# EAGLE design flexglove (EAGLE 7.7.0)
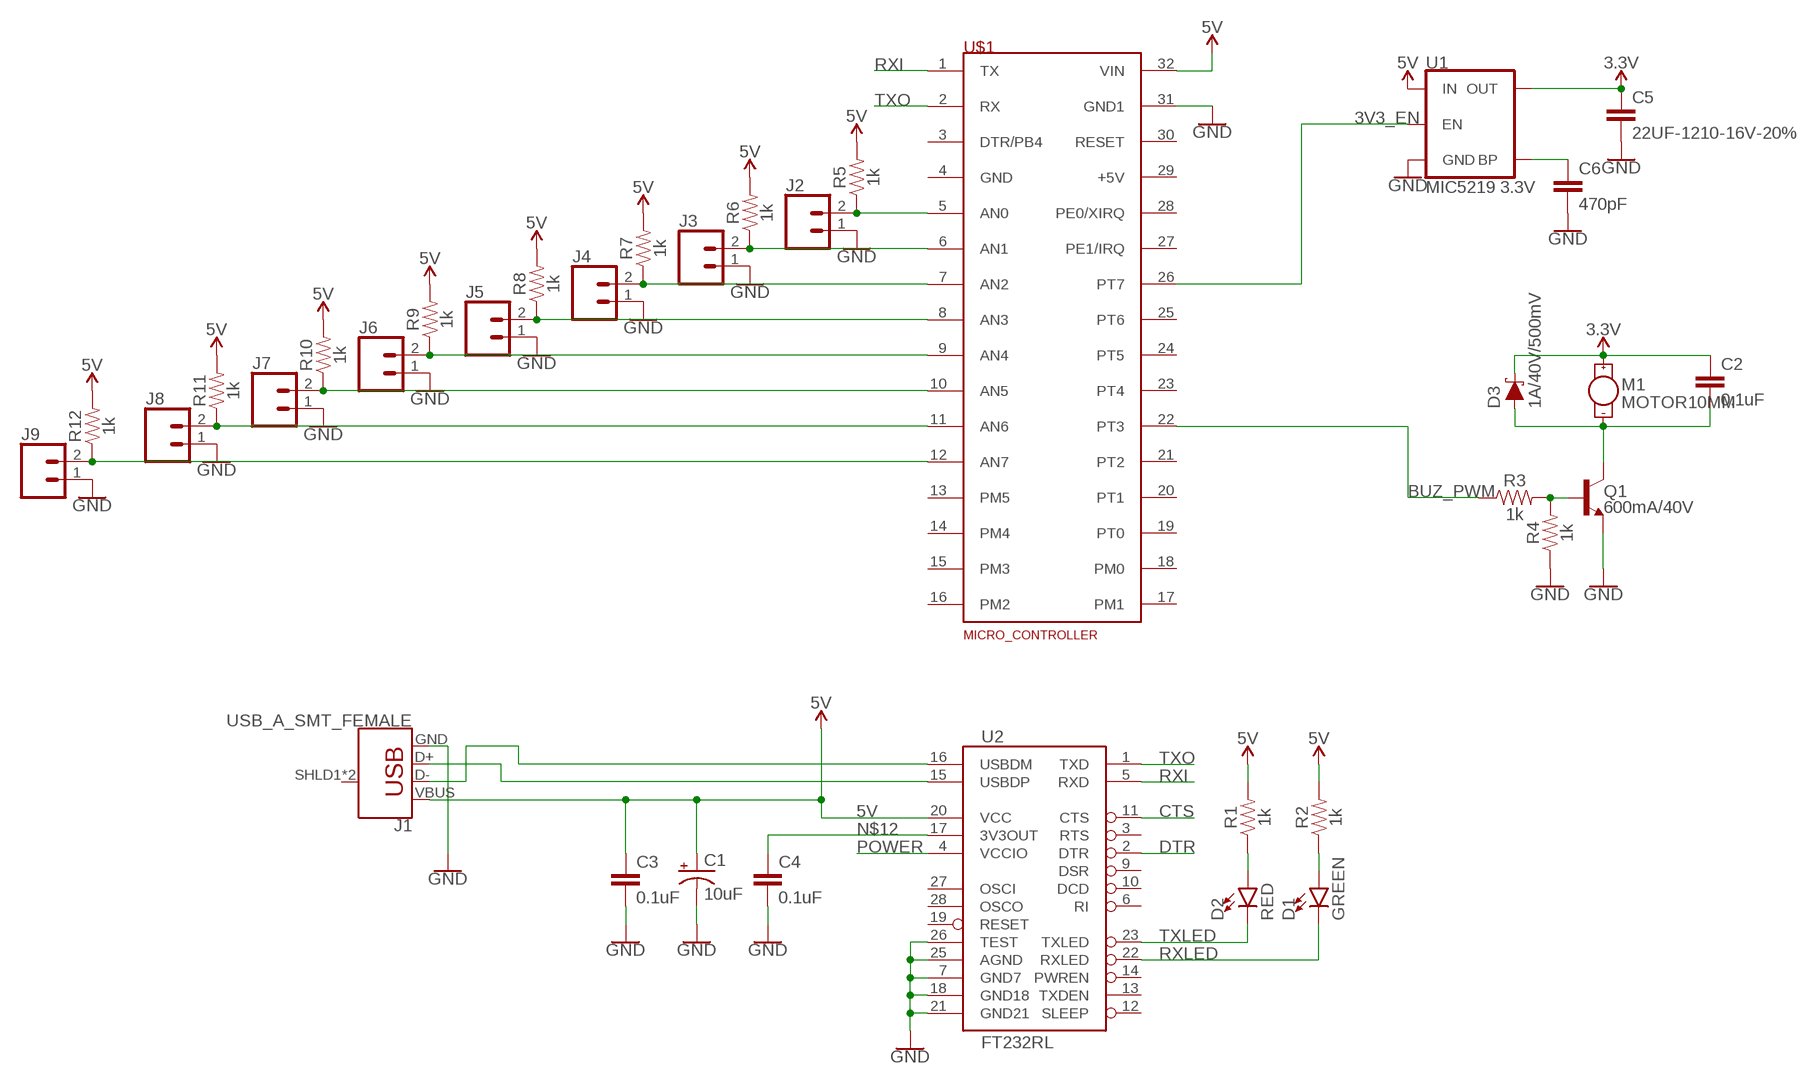
[diagram p0: schematic, sheet 1]

## Parts
C1  10uF  10UF-POLAR-EIA3216-16V-10%(TANT)  [EIA3216]
C2  0.1uF  0.1UF-0603-25V-5%  [0603]
C3  0.1uF  0.1UF-0603-25V-5%  [0603]
C4  0.1uF  0.1UF-0603-25V-5%  [0603]
C5  22UF-1210-16V-20%  [1210]
C6  470pF  470PF-0603-50V-5%  [0603]
D1  GREEN  LED-GREEN0603  [LED-0603]
D2  RED  LED-RED0603  [LED-0603]
D3  1A/40V/500mV  DIODE-SCHOTTKY-SS14  [SMA-DIODE]
J1  USB_A_SMT_FEMALE  [USB-A-S-SILK-FEMALE]
J2  CONN_02  [1X02]
J3  CONN_02  [1X02]
J4  CONN_02  [1X02]
J5  CONN_02  [1X02]
J6  CONN_02  [1X02]
J7  CONN_02  [1X02]
J8  CONN_02  [1X02]
J9  CONN_02  [1X02]
M1  MOTOR10MM  [VIBE-MOTOR-10MM]
Q1  600mA/40V  TRANS_NPN-MMBT2222AL  [SOT23-3]
R1  1k  1KOHM-0603-1/10W-1%  [0603]
R2  1k  1KOHM-0603-1/10W-1%  [0603]
R3  1k  1KOHM-0603-1/10W-1%  [0603]
R4  1k  1KOHM-0603-1/10W-1%  [0603]
R5  1k  1KOHM-0603-1/10W-1%  [0603]
R6  1k  1KOHM-0603-1/10W-1%  [0603]
R7  1k  1KOHM-0603-1/10W-1%  [0603]
R8  1k  1KOHM-0603-1/10W-1%  [0603]
R9  1k  1KOHM-0603-1/10W-1%  [0603]
R10  1k  1KOHM-0603-1/10W-1%  [0603]
R11  1k  1KOHM-0603-1/10W-1%  [0603]
R12  1k  1KOHM-0603-1/10W-1%  [0603]
U1  MIC5219 3.3V  V_REG_MIC52193.3V  [SOT23-5]
U2  FT232RL  FT232RLSSOP  [SSOP28DB]
U$1  MICRO_CONTROLLER  [MICRO_CONTROLLER]

## Nets
3.3V [power]: C2.1 C5.1 D3.C M1.+ U1.5(OUT)
3V3_EN: U1.3(EN) U$1.26(PT7)
5V: C1.+ C3.1 J1.VBUS R1.2 R2.2 R5.2 R6.2 R7.2 R8.2 R9.2 R10.2 R11.2 R12.2 U1.1(IN) U2.20(VCC) U$1.32(VIN)
BUZ_PWM: R3.1 U$1.22(PT3)
CTS: U2.11(CTS)
DTR: U2.2(DTR)
GND [power]: C1.- C3.2 C4.2 C5.2 C6.2 J1.GND J2.1 J3.1 J4.1 J5.1 J6.1 J7.1 J8.1 J9.1 Q1.2(E) R4.1 U1.2(GND) U2.7(GND7) U2.18(GND18) U2.21(GND21) U2.25(AGND) U2.26(TEST) U$1.31(GND1)
N$1: D2.A R1.1
N$2: D1.A R2.1
N$3: J2.2 R5.1 U$1.5(AN0)
N$4: J3.2 R6.1 U$1.6(AN1)
N$5: J5.2 R8.1 U$1.8(AN3)
N$6: J6.2 R9.1 U$1.9(AN4)
N$7: J7.2 R10.1 U$1.10(AN5)
N$8: J4.2 R7.1 U$1.7(AN2)
N$9: J8.2 R11.1 U$1.11(AN6)
N$10: J9.2 R12.1 U$1.12(AN7)
N$11: Q1.1(B) R3.2 R4.2
N$12 [power]: C4.1 U2.17(3V3OUT)
N$13: C2.2 D3.A M1.- Q1.3(C)
N$14: C6.1 U1.4(BP)
POWER: U2.4(VCCIO)
RXI: U2.5(RXD) U$1.1(TX)
RXLED: D1.C U2.22(RXLED)
TXLED: D2.C U2.23(TXLED)
TXO: U2.1(TXD) U$1.2(RX)
USB_D+: J1.D+ U2.15(USBDP)
USB_D-: J1.D- U2.16(USBDM)
Unconnected: J1.SHLD1(SHIELD) J1.SHLD2(SHIELD) U2.3(RTS) U2.6(RI) U2.9(DSR) U2.10(DCD) U2.12(SLEEP) U2.13(TXDEN) U2.14(PWREN) U2.19(RESET) U2.27(OSCI) U2.28(OSCO) U$1.3(DTR/PB4) U$1.4(GND) U$1.13(PM5) U$1.14(PM4) U$1.15(PM3) U$1.16(PM2) U$1.17(PM1) U$1.18(PM0) U$1.19(PT0) U$1.20(PT1) U$1.21(PT2) U$1.23(PT4) U$1.24(PT5) U$1.25(PT6) U$1.27(PE1/IRQ) U$1.28(PE0/XIRQ) U$1.29(+5V) U$1.30(RESET)

## Library data of the parts
C1 = SparkFun-Capacitors:10UF-POLAR: 10.0µF polarized capacitors A capacitor is a passive two-terminal electrical component used to store electrical energy temporarily in an electric field.; PROD_ID: CAP-00811
C2-C4 = SparkFun-Capacitors:0.1UF: 0.1µF ceramic capacitors A capacitor is a passive two-terminal electrical component used to store electrical energy temporarily in an electric field.; PROD_ID: CAP-08604
C5 = SparkFun-Capacitors:22UF: 22µF ceramic capacitors A capacitor is a passive two-terminal electrical component used to store electrical energy temporarily in an electric field.
C6 = SparkFun-Capacitors:470PF: 470pF ceramic capacitors A capacitor is a passive two-terminal electrical component used to store electrical energy temporarily in an electric field.; PROD_ID: CAP-07884
D1 = SparkFun-LED:LED-GREEN: Green SMD LED Used in manufacturing of various products at SparkFun Packages: 0603 - SMD 0603 package [Product Link] <http://www.futureelectronics.com/en/technologies/semiconductors/optoelectronics/leds/Pages/9894312-LTST-C190GKT.aspx?CrossPart=HSMG-C190&IM=0> LilyPad 1206 - SMD1206 LilyPad package [Product Link] <http://www.futureelectronics.com/en/Technologies/Product.aspx?ProductID=IN150NGHARVATEKCORPORATION2049943&IM=0> 1206 - SMD1206 package [Product Link] <http://www.futureelectronics.com/en/technologies/semiconductors/optoelectronics/leds/Pages/8315665-LTST-C150KGKT.aspx?IM=0> 1206 Bottom Mount -SMD 1206 Bottom Mount [Product Link] <http://www.digikey.com/product-detail/en/lite-on-inc/LTST-C230KGKT/160-1456-1-ND/386854> SparkFun Products: Pro Mini 328 -5V <https://www.sparkfun.com/products/821> RedBoard <https://www.sparkfun.com/products/12757> MP3 Trigger <https://www.sparkfun.com/products/13720> Makey Makey <https://www.sparkfun.com/products/11076>; PROD_ID: DIO-00821
D2 = SparkFun-LED:LED-RED: Red SMD LED Used in manufacturing of most products at SparkFun Packages: 0603 - SMD 0603 package [Product Link] <http://docs.avagotech.com/docs/AV02-0551EN> 0603 SMART - SMD 0603 SMART package ( more efficient and expensive)[Product Link] <http://www.osram-os.com/Graphics/XPic2/00077099_0.pdf> 1206 - SMD1206 package [Product Link] <https://www.sparkfun.com/datasheets/DevTools/LilyPad/Q150OVS4.pdff> SparkFun Products: Pro Mini 328 -5V <https://www.sparkfun.com/products/821> RedBoard <https://www.sparkfun.com/products/12757> IOIO-OTG <https://www.sparkfun.com/products/13613>; PROD_ID: DIO-00819
D3 = SparkFun-DiscreteSemi:DIODE-SCHOTTKY: Schottky diode A Schottky diode is a semiconductor diode which has a low forward voltage drop and a very fast switching action.; PROD_ID: DIO-08053
J1 = SparkFun-Connectors:USB_A: USB-A Connector Male and female variants, as well as PTH and SMT variants SparkFun Products: SparkFun XBee Explorer Dongle <https://www.sparkfun.com/products/11697> PTH Male SparkFun MicroView-USB Programmer <https://www.sparkfun.com/products/12924> SMT Male SparkFun USB Type A Female Breakout <https://www.sparkfun.com/products/12700> SMT Female; PROD_ID: CONN-09520; SF_ID: PRT-09011
J2-J9 = SparkFun-Connectors:CONN_02: Multi connection point. Often used as Generic Header-pin footprint for 0.1 inch spaced/style header connections On any of the 0.1 inch spaced packages, you can populate with these: Break Away Headers - Straight <https://www.sparkfun.com/products/116> (PRT-00116) Break Away Male Headers - Right Angle <https://www.sparkfun.com/products/553> (PRT-00553) Female Headers <https://www.sparkfun.com/products/115> (PRT-00115) Break Away Headers - Machine Pin <https://www.sparkfun.com/products/117> (PRT-00117) Break Away Female Headers - Swiss Machine Pin <https://www.sparkfun.com/products/743> (PRT-00743) For SCREWTERMINALS and SPRING TERMINALS visit here: Screw Terimnals on SparkFun.com <https://www.sparkfun.com/search/results?term=Screw+Terminals> (5mm/3.5mm/2.54mm spacing) This device is also useful as a general connection point to wire up your design to another part of your project. Our various solder wires solder well into these plated through hole pads. Hook-Up Wire - Assortment (Stranded, 22 AWG) <https://www.sparkfun.com/products/11375> (PRT-11375) Hook-Up Wire - Assortment (Solid Core, 22 AWG) <https://www.sparkfun.com/products/11367> (PRT-11367) View the entire wire category on our website here <https://www.sparkfun.com/categories/141> Special notes: Molex polarized connector foot print use with: PRT-08233 with associated crimp pins and housings. 2.54_SCREWTERM for use with PRT-10571. 3.5mm Screw Terminal footprints for PRT-08084 5mm Screw Terminal footprints for use with PRT-08432
M1 = SparkFun-Electromechanical:MOTOR: Motor (Single-Phase) Two-terminal, single-phase motors. SparkFun Products Vibration Motor <https://www.sparkfun.com/products/8449> (ROB-08449) Physical dimension and wire connections for this powerful vibration motor. Motor has a self adhesive backing.; PROD_ID: COMP-08572; SF_SKU: ROB-08449
Q1 = SparkFun-DiscreteSemi:TRANS_NPN: NPN transistor Current controlled devices typically used to amplify current or used as a switch. BC547 - COM-08928 <http://www.sparkfun.com/products/8928> (TO-92 45V 100mA) (1.Collector 2.Base 3.Emitter) 2N3904 - COM-00521 <http://www.sparkfun.com/products/521> (TO-92 40V 200mA) (1.Emitter 2.Base 3.Collector) P2N2222A - COM-12852 <http://www.sparkfun.com/products/12852> (TO-92 40V 600mA) (1.Collector 2.Base 3.Emitter); PROD_ID: TRANS-08049
R1-R12 = SparkFun-Resistors:1KOHM: 1kΩ resistor A resistor is a passive two-terminal electrical component that implements electrical resistance as a circuit element. Resistors act to reduce current flow, and, at the same time, act to lower voltage levels within circuits. - Wikipedia; PROD_ID: RES-07856
U1 = SparkFun-IC-Power:V_REG_MIC5219: V_REG MIC5219 Standard 3.3V and 5V 500mA LDO voltage regulator in SOT-23 layout. Micrel part MIC5219. BP (by-pass) pin is used to lower output noise with 470pF cap, may be left open.; PROD_ID: VREG-09872
U2 = SparkFun-IC-Comms:FT232RL: FT232RL USB UART FT232RL 4th Generation USB UART (USB <-> Serial) Controller. Datasheet <http://www.sparkfun.com/datasheets/IC/FT232R_v104.pdf> SparkFun Products Component <https://www.sparkfun.com/products/650> (COM-00650) SparkFun RedBot Mainboard <https://www.sparkfun.com/products/12097> (ROB-12097) SparkFun FTDI Basic Breakout - 5V <https://www.sparkfun.com/products/9716> (DEV-09716) SparkFun FTDI Basic Breakout - 3.3V <https://www.sparkfun.com/products/9873> (DEV-09873) Bus Pirate - v3.6a <https://www.sparkfun.com/products/12942> (TOL-12942) SparkFun USB to Serial Breakout - FT232RL <https://www.sparkfun.com/products/12731> (BOB-12731) SparkFun PicoBoard <https://www.sparkfun.com/products/11888> (WIG-11888) SparkFun RFID USB Reader <https://www.sparkfun.com/products/9963> (SEN-09963) LilyPad FTDI Basic Breakout - 5V <https://www.sparkfun.com/products/10275> (DEV-10275) SparkFun Stepoko <https://www.sparkfun.com/products/13899> (ROB-13899); PROD_ID: IC-00870
U$1 = mini_project_parts:MICRO_CONTROLLER

## Net classes
0 default: width 0.203 mm
1 power: width 0.254 mm

## Board
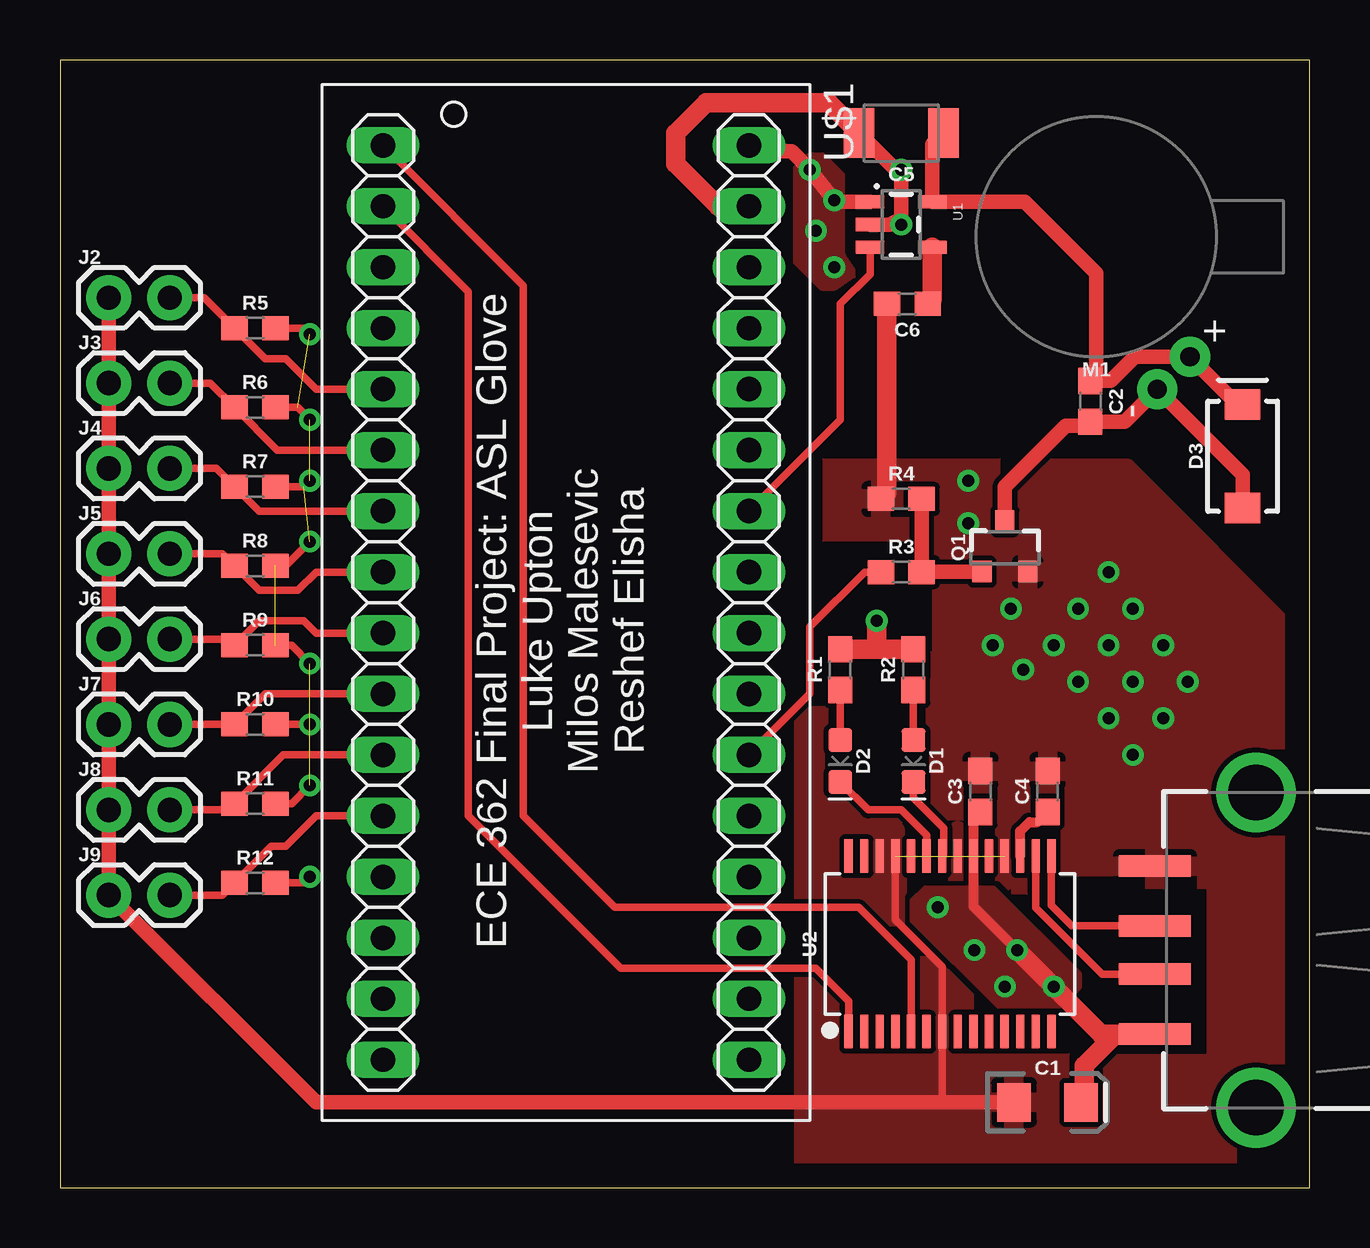
[diagram p1: board, top side]
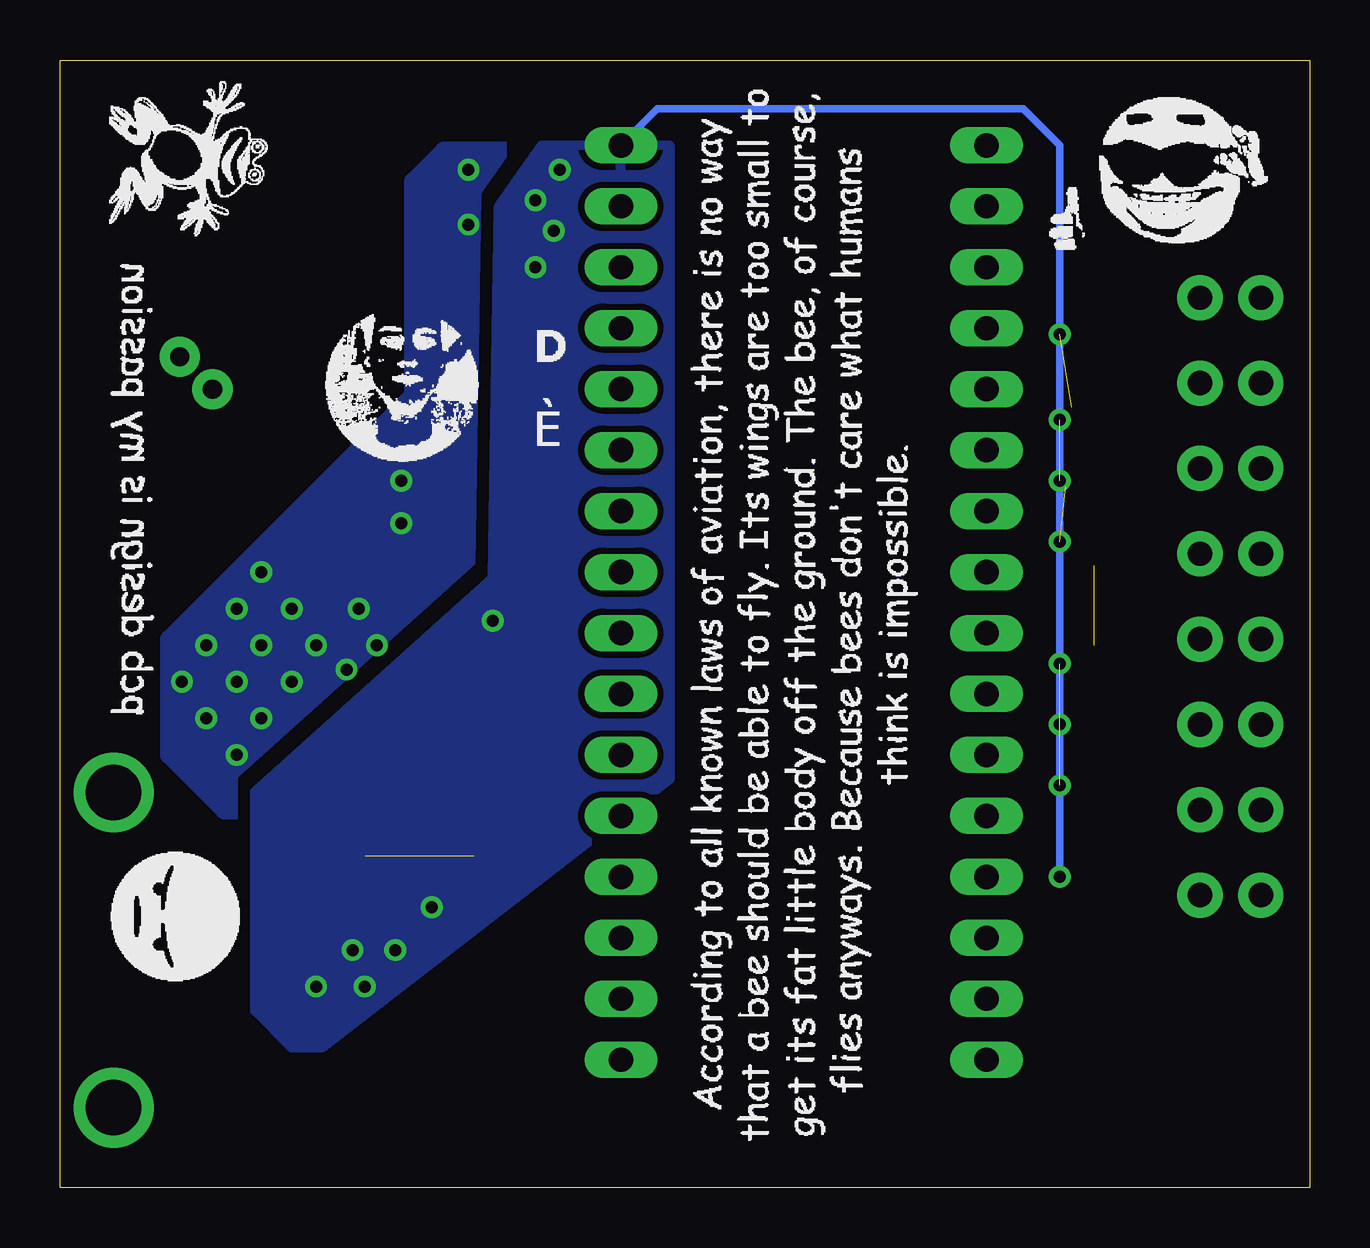
[diagram p2: board, bottom side, seen from below]

Size 52.07 x 46.99 mm. Coordinates in mm from the lower left corner, seen from the top.
Outline: 0,0 52.07,0 52.07,46.99 0,46.99 0,0
Copper layers (1*16): Top 0.035mm / dielectric 1.5mm / Bottom 0.035mm
Design rules "default *": minimum track width 10mil, minimum drill 12mil, track to track 8mil, track to pad 8mil, pad to pad 8mil, via to via 8mil, smd to smd 8mil, copper to edge 40mil, drill to drill 8mil, minimum pad ring 10mil, minimum via ring 8mil, stop-mask expansion 4mil, vias tented up to drill 24mil, thermal gap 10mil
tRestrict: area 43.9,5.6 to 47.8,12.4; area 41.4,11.2 to 44.2,13; area 30,23.1 to 31.8,30.7; area 30.2,24.1 to 36.1,26.9; area 34.3,22.4 to 36.3,24.9

### Footprints (pad centres in the part's own frame; a part is rotated, then mirrored left to right if it is on the bottom)
EIA3216 = smd 1.4 x 1.6: + 1.4,0; - -1.4,0
0603 = smd 1.1 x 1: 1 -0.85,0; 2 0.85,0
1210 = smd 1.27 x 2.06: 1 -1.755,0; 2 1.755,0
LED-0603 = smd 1 x 1: A -0.877,0; C 0.877,0
SMA-DIODE = smd 1.27 x 1.47: A -2.15,0; C 2.15,0
USB-A-S-SILK-FEMALE = smd 3 x 0.9: D+ 7.212,-1; D- 7.212,1; GND 7.212,-3.5; VBUS 7.212,3.5 | drill 2.311: SHLD1 3,-6.566; SHLD2 3,6.566
1X02 = drill 1.016 pad 1.88: 1 0,0; 2 2.54,0
VIBE-MOTOR-10MM = drill 0.8 pad 1.676: + -5,-3.9; - -6.35,-2.54
SOT23-3 = smd 0.8 x 0.9: 1 -0.95,-1; 2 0.95,-1; 3 0,1.1
SOT23-5 = smd 0.55 x 1.2: 1 -0.95,-1.3; 2 0,-1.3; 3 0.95,-1.3; 4 0.95,1.3; 5 -0.95,1.3
SSOP28DB = smd 0.348 x 1.397: 1 -4.225,-3.656; 2 -3.575,-3.656; 3 -2.925,-3.656; 4 -2.275,-3.656; 5 -1.625,-3.656; 6 -0.975,-3.656; 7 -0.325,-3.656; 8 0.325,-3.656; 9 0.975,-3.656; 10 1.625,-3.656; 11 2.275,-3.656; 12 2.925,-3.656; 13 3.575,-3.656; 14 4.225,-3.656; 15 4.225,3.656; 16 3.575,3.656; 17 2.925,3.656; 18 2.275,3.656; 19 1.625,3.656; 20 0.975,3.656; 21 0.325,3.656; 22 -0.325,3.656; 23 -0.975,3.656; 24 -1.625,3.656; 25 -2.275,3.656; 26 -2.925,3.656; 27 -3.575,3.656; 28 -4.225,3.656
MICRO_CONTROLLER = drill 1.016 long: 1 0,0; 2 2.54,0; 3 5.08,0; 4 7.62,0; 5 10.16,0; 6 12.7,0; 7 15.24,0; 8 17.78,0; 9 20.32,0; 10 22.86,0; 11 25.4,0; 12 27.94,0; 13 30.48,0; 14 33.02,0; 15 35.56,0; 16 38.1,0; 17 38.1,15.24; 18 35.56,15.24; 19 33.02,15.24; 20 30.48,15.24; 21 27.94,15.24; 22 25.4,15.24; 23 22.86,15.24; 24 20.32,15.24; 25 17.78,15.24; 26 15.24,15.24; 27 12.7,15.24; 28 10.16,15.24; 29 7.62,15.24; 30 5.08,15.24; 31 2.54,15.24; 32 0,15.24

### Placement (x,y rotation side)
C1  41.15,3.56 0 top
C2  42.93,32.77 270 top
C3  38.35,16.51 90 top
C4  41.15,16.51 90 top
C5  35.05,43.94 180 top
C6  35.31,36.83 180 top
D1  35.56,17.78 270 top
D2  32.51,17.78 270 top
D3  49.28,30.48 90 top
J1  52.83,9.91 180 top
J2  2.03,37.08 0 top
J3  2.03,33.53 0 top
J4  2.03,29.97 0 top
J5  2.03,26.42 0 top
J6  2.03,22.86 0 top
J7  2.03,19.3 0 top
J8  2.03,15.75 0 top
J9  2.03,12.19 0 top
M1  43.18,39.62 90 top
Q1  39.37,26.67 0 top
R1  32.51,21.59 90 top
R2  35.56,21.59 90 top
R3  35.05,25.65 0 top
R4  35.05,28.7 0 top
R5  8.13,35.81 0 top
R6  8.13,32.51 0 top
R7  8.13,29.21 0 top
R8  8.13,25.91 0 top
R9  8.13,22.61 0 top
R10  8.13,19.3 0 top
R11  8.13,16 0 top
R12  8.13,12.7 0 top
U1  35.05,40.13 270 top
U2  37.08,10.16 0 top
U$1  13.46,43.43 270 top

### Tracks (layer width: path | path; a pad name or v marks a point on that pad's centre or on a via)
3.3V
  Top 0.61: C5.1 36.35,43.49 U1.5 40.2,41.08 43.18,38.1 43.18,33.87 C2.1 43.78,33.62 44.78,34.62 M1.+ 49.07,32.63 D3.C
3V3_EN
  Top 0.305: U1.3 33.75,38.07 32.51,36.83 32.51,32 U$1.26
5V  (via drill 0.5 pad 0.3, 0.5 pad 0.41)  (6 unrouted)
  Top 0.305: R10.2 10.41,19.3 | R11.2 9.65,16 v10.41,16.76 | R12.2 10.16,12.7 v10.41,12.95 | R9.2 9.65,22.61 10.41,21.84 | R8.2 9.4,25.91 10.41,26.92 | R7.2 10.16,29.21 10.41,29.46 | R6.2 9.91,32.51 10.41,32 | R5.2 10.16,35.81 10.41,35.56
  Top 0.406: C3.1 38.06,15.37 U2.20 38.06,11.72 v39.88,9.91
  Top 0.61: U1.1 32.58,41.08 v32.26,41.15 v31.24,42.42 30.48,43.18 28.96,43.18 U$1.32
  Top 0.813: C1.+ 42.67,3.68 42.67,5.08 44,6.41 J1.VBUS 43.38,6.41 v41.4,8.38 v39.88,9.91 | R1.2 R2.2 34.04,22.44 v34.04,23.62
  Bottom 0.305: v10.41,12.95 v10.41,16.76 10.41,43.43 11.94,44.96 27.18,44.96 U$1.32
  other vias: 31.5,39.88 32.26,38.35 36.58,11.68 38.1,9.91 39.37,8.38
  pour Top: 30.73,42.42 30.73,38.61 31.75,37.59 32.26,37.59 33.02,38.1 32.51,38.86 32.51,42.16 31.75,42.93 31.24,42.93
  pour Bottom (isolate 0.254): 26.67,43.43 26.67,17.02 41.15,5.84 42.42,5.84 43.94,7.37 43.94,16.51 34.04,25.4 33.78,40.89 32,43.43
  pour Top: 35.56,11.18 39.12,7.62 41.66,7.62 42.42,8.38 42.42,8.89 38.86,12.45 36.07,12.45 35.56,11.94
BUZ_PWM
  Top 0.305: R3.1 33.53,25.65 31.24,23.37 31.24,20.57 U$1.22
GND  (via drill 0.5 pad 0.41)  (2 unrouted)
  Top 0.305: C1.- 36.76,3.56 U2.7 36.76,9.21 34.81,11.16 U2.25
  Top 0.61: U1.2 34.54,40.13 35.05,40.39 v35.05,42.42 34.8,42.44 C5.2 | J2.1 J3.1 J4.1 J5.1 J6.1 J7.1 J8.1 J9.1 10.67,3.56 C1.-
  Top 0.813: C6.2 34.46,28.96 R4.1 | U$1.31 27.43,40.89 25.65,42.67 25.65,43.94 26.92,45.21 32.03,45.21 C5.2
  other vias: 37.85,29.46 37.85,27.69 43.69,25.65 42.42,24.13 39.62,24.13 38.86,22.61 40.13,21.59 41.4,22.61 42.42,21.08 43.69,22.61 44.7,24.13 45.97,22.61 46.99,21.08 44.7,21.08 45.97,19.56 43.69,19.56 44.7,18.03 35.05,40.13
  pour Top (rank 2): 51.56,0.51 30.99,0.51 30.99,29.97 44.45,29.97 51.56,22.86
  pour Bottom (isolate 0.508, rank 2): 31.75,43.18 31.75,37.85 33.53,37.85 33.53,24.64 34.04,24.64 42.93,15.75 45.21,15.75 47.5,18.03 47.5,22.86 37.34,33.02 37.34,41.91 36.07,43.18
N$1
  Top 0.305: R1.1 D2.A
N$2
  Top 0.305: R2.1 D1.A
N$3
  Top 0.305: U$1.5 10.67,33.27 9.4,34.54 8.55,34.54 R5.1 6.01,37.08 J2.2
N$4
  Top 0.305: U$1.6 9.06,30.73 R6.1 6.26,33.53 J3.2
N$5
  Top 0.305: U$1.8 10.67,25.65 9.91,24.89 8.29,24.89 R8.1 6.77,26.42 J5.2
N$6
  Top 0.305: U$1.9 10.67,23.11 10.16,23.62 8.29,23.62 R9.1 7.02,22.86 J6.2
N$7
  Top 0.305: U$1.10 8.55,20.57 R10.1 J7.2
N$8
  Top 0.305: U$1.7 8.29,28.19 R7.1 6.52,29.97 J4.2
N$9
  Top 0.305: U$1.11 9.31,18.03 R11.1 7.02,15.75 J8.2
N$10
  Top 0.305: U$1.12 10.67,15.49 9.4,14.22 8.8,14.22 R12.1 6.77,12.19 J9.2
N$11
  Top 0.61: R4.2 R3.2 35.92,25.67 Q1.1
N$12
  Top 0.406: U2.17 40.01,14.86 40.39,15.24 40.73,15.24 C4.1
N$13
  Top 0.61: D3.A 49.28,29.72 M1.- 44.36,31.92 C2.2 42.76,31.75 41.91,31.75 39.37,29.21 Q1.3
N$14
  Top 0.813: U1.4 36.35,37.03 C6.1
N$15  (via drill 0.5 pad 0.41)
  other vias: 10.41,19.3
N$17  (via drill 0.5 pad 0.41)
  other vias: 10.41,21.84
N$18  (via drill 0.5 pad 0.41)
  other vias: 10.41,26.92
N$19  (via drill 0.5 pad 0.41)
  other vias: 10.41,29.46
N$20  (via drill 0.5 pad 0.41)
  other vias: 10.41,32
N$21  (via drill 0.5 pad 0.41)
  other vias: 10.41,35.56
RXI
  Top 0.305: U2.5 35.46,9.5 33.27,11.68 23.11,11.68 19.3,15.49 19.3,37.59 U$1.1
RXLED
  Top 0.305: D1.C 35.56,16.26 36.83,14.99 36.83,13.89 U2.22
TXLED
  Top 0.305: U2.23 36.11,14.69 35.05,15.75 33.67,15.75 D2.C
TXO
  Top 0.305: U$1.2 17.02,37.34 17.02,15.49 23.37,9.14 31.5,9.14 32.86,7.78 U2.1
USB_D+
  Top 0.305: U2.15 41.31,11.78 42.16,10.92 45.6,10.92 J1.D+
USB_D-
  Top 0.305: U2.16 40.66,11.66 43.43,8.89 45.6,8.89 J1.D-

### Text on the board
tPlace: ECE 362 Final Project: ASL Glove / Luke Upton / Milos Malesevic / Reshef Elisha